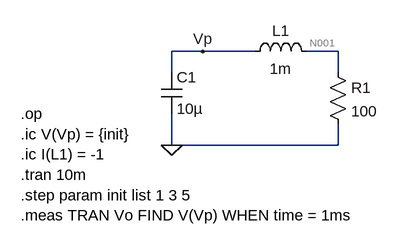
[diagram p0: schematic learning.asc]
learning.asc, the LTspice schematic file:
Version 4
SHEET 1 880 680
WIRE 16 144 -32 144
WIRE 96 144 16 144
WIRE 224 144 176 144
WIRE -32 176 -32 144
WIRE 224 176 224 144
WIRE -32 288 -32 240
WIRE 224 288 224 256
WIRE 224 288 -32 288
FLAG -32 288 0
FLAG 16 144 Vp
SYMBOL Res 208 160 R0
SYMATTR InstName R1
SYMATTR Value 100
SYMBOL Cap -48 176 R0
SYMATTR InstName C1
SYMATTR Value 10µ
SYMBOL ind 80 160 R270
WINDOW 0 32 56 VTop 2
WINDOW 3 5 56 VBottom 2
SYMATTR InstName L1
SYMATTR Value 1m
TEXT -264 240 Left 2 !.op\n.ic V(Vp) = {init}\n.ic I(L1) = -1\n.tran 10m\n.step param init list 1 3 5\n.meas TRAN Vo FIND V(Vp) WHEN time = 1ms

The netlist it stands for:
* learning.asc
R1 N001 0 100
C1 Vp 0 10µ
L1 Vp N001 1m
.op
.ic V(Vp) = {init}
.ic I(L1) = -1
.tran 10m
.step param init list 1 3 5
.meas TRAN Vo FIND V(Vp) WHEN time = 1ms
.backanno
.end

* Results of the author's LTspice run, read from the files saved beside the schematic
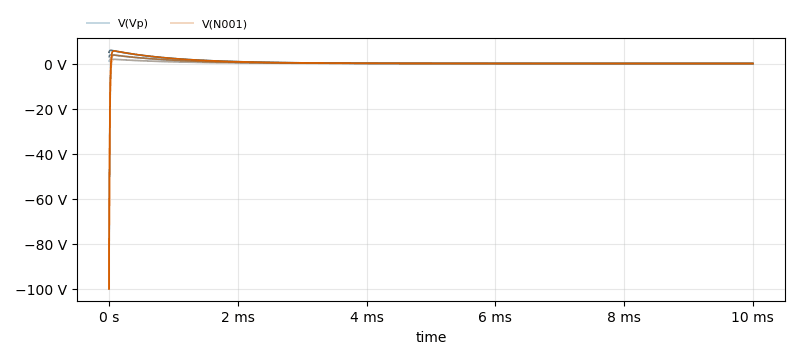
[diagram p1: Transient Analysis of learning.asc, plotted from the saved traces]
* Transient Analysis, 3 runs:
*   V(Vp) [init=1]: min 83.26 µV, max 1.932 V, average 200.2 mV, rms 448.8 mV, last 83.26 µV
*   V(Vp) [init=3]: min 166.1 µV, max 3.88 V, average 400.5 mV, rms 899.2 mV, last 166.1 µV
*   V(Vp) [init=5]: min 248.9 µV, max 5.837 V, average 600.8 mV, rms 1.35 V, last 248.9 µV
*   V(N001) [init=1]: min -100 V, max 1.859 V, average 97.03 mV, rms 2.318 V, last 84.11 µV
*   V(N001) [init=3]: min -100 V, max 3.738 V, average 297.4 mV, rms 2.401 V, last 167.8 µV
*   V(N001) [init=5]: min -100 V, max 5.618 V, average 497.7 mV, rms 2.561 V, last 251.5 µV
* From the log:
*   Measurement: vo
*     step  v(vp)  at
*        1  0.74098  0.001
*        2  1.4788  0.001
*        3  2.216  0.001